# EAGLE design Power Distribution (EAGLE 6.4)
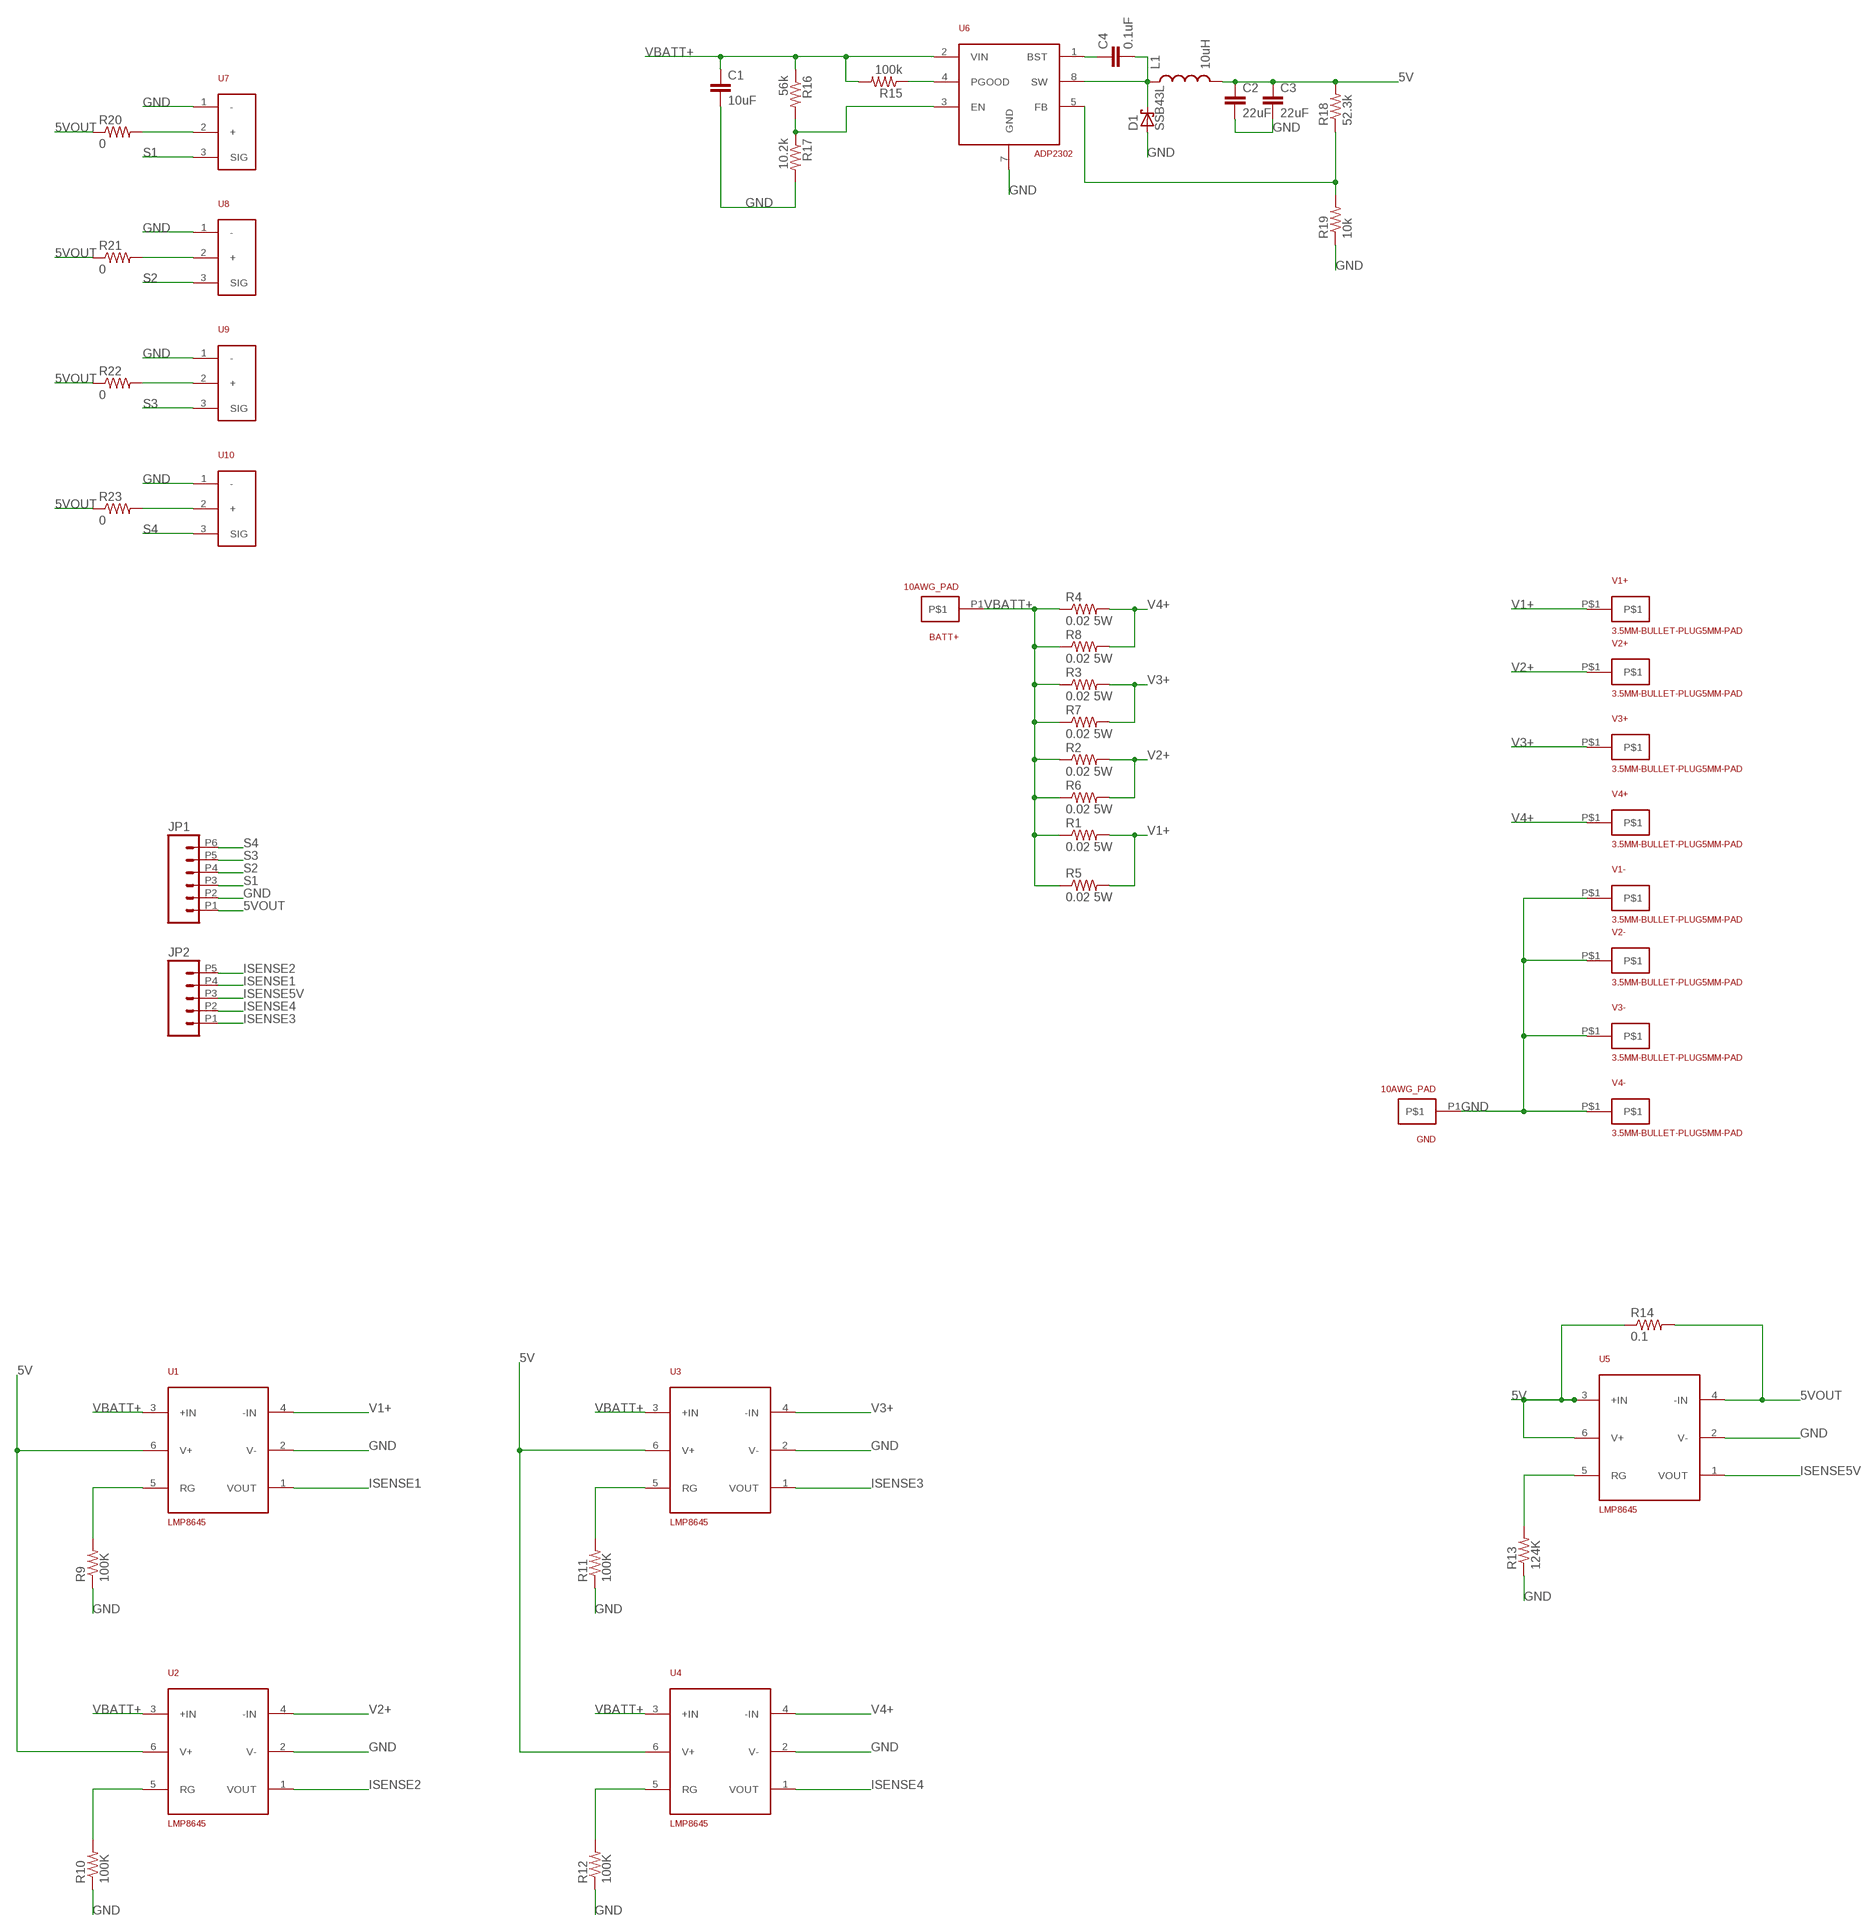
[diagram p0: schematic, sheet 1]

## Parts
BATT+  10AWG_PAD  [10AWG_SOLDERPAD]
C1  10uF  CAP0603-CAP  [0603-CAP]
C2  22uF  CAP0603-CAP  [0603-CAP]
C3  22uF  CAP0603-CAP  [0603-CAP]
C4  0.1uF  CAP0603-CAP  [0603-CAP]
D1  SSB43L  SCHOTTKY-DIODESMD  [SMB]
GND  10AWG_PAD  [10AWG_SOLDERPAD]
JP1  M06DF13  [DF13A-6P-1.25H]
JP2  M05DF13  [DF13A-5P-1.25H]
L1  10uH  INDUCTOR0603  [0603]
R1  0.02 5W  RESISTOR2512  [R2512]
R2  0.02 5W  RESISTOR2512  [R2512]
R3  0.02 5W  RESISTOR2512  [R2512]
R4  0.02 5W  RESISTOR2512  [R2512]
R5  0.02 5W  RESISTOR2512  [R2512]
R6  0.02 5W  RESISTOR2512  [R2512]
R7  0.02 5W  RESISTOR2512  [R2512]
R8  0.02 5W  RESISTOR2512  [R2512]
R9  100K  RESISTOR0603-RES  [0603-RES]
R10  100K  RESISTOR0603-RES  [0603-RES]
R11  100K  RESISTOR0603-RES  [0603-RES]
R12  100K  RESISTOR0603-RES  [0603-RES]
R13  124K  RESISTOR0603-RES  [0603-RES]
R14  0.1  RESISTOR0603-RES  [0603-RES]
R15  100k  RESISTOR0603-RES  [0603-RES]
R16  56k  RESISTOR0603-RES  [0603-RES]
R17  10.2k  RESISTOR0603-RES  [0603-RES]
R18  52.3k  RESISTOR0603-RES  [0603-RES]
R19  10k  RESISTOR0603-RES  [0603-RES]
R20  0  RESISTOR0603-RES  [0603-RES]
R21  0  RESISTOR0603-RES  [0603-RES]
R22  0  RESISTOR0603-RES  [0603-RES]
R23  0  RESISTOR0603-RES  [0603-RES]
U1  LMP8645  [SOT23-6]
U2  LMP8645  [SOT23-6]
U3  LMP8645  [SOT23-6]
U4  LMP8645  [SOT23-6]
U5  LMP8645  [SOT23-6]
U6  ADP2302  [SOIC8]
U7  SERVOPLUGTHROUGHHOLE_0.1PITCH  [0.1-PITCH-3CONN_RANGLE]
U8  SERVOPLUGTHROUGHHOLE_0.1PITCH  [0.1-PITCH-3CONN_RANGLE]
U9  SERVOPLUGTHROUGHHOLE_0.1PITCH  [0.1-PITCH-3CONN_RANGLE]
U10  SERVOPLUGTHROUGHHOLE_0.1PITCH  [0.1-PITCH-3CONN_RANGLE]
V1+  3.5MM-BULLET-PLUG5MM-PAD  [5MMPLUG]
V1-  3.5MM-BULLET-PLUG5MM-PAD  [5MMPLUG]
V2+  3.5MM-BULLET-PLUG5MM-PAD  [5MMPLUG]
V2-  3.5MM-BULLET-PLUG5MM-PAD  [5MMPLUG]
V3+  3.5MM-BULLET-PLUG5MM-PAD  [5MMPLUG]
V3-  3.5MM-BULLET-PLUG5MM-PAD  [5MMPLUG]
V4+  3.5MM-BULLET-PLUG5MM-PAD  [5MMPLUG]
V4-  3.5MM-BULLET-PLUG5MM-PAD  [5MMPLUG]

## Nets
5V: C2.1 C3.1 L1.2 R14.1 R18.2 U1.6(V+) U2.6(V+) U3.6(V+) U4.6(V+) U5.3(+IN) U5.6(V+)
5VOUT: JP1.P1 R14.2 R20.1 R21.1 R22.1 R23.1 U5.4(-IN)
GND: C1.2 C2.2 C3.2 D1.A GND.P1 JP1.P2 R9.1 R10.1 R11.1 R12.1 R13.1 R17.2 R19.1 U1.2(V-) U2.2(V-) U3.2(V-) U4.2(V-) U5.2(V-) U6.7(GND) U7.1(-) U8.1(-) U9.1(-) U10.1(-) V1-.P$1 V2-.P$1 V3-.P$1 V4-.P$1
ISENSE1: JP2.P4 U1.1(VOUT)
ISENSE2: JP2.P5 U2.1(VOUT)
ISENSE3: JP2.P1 U3.1(VOUT)
ISENSE4: JP2.P2 U4.1(VOUT)
ISENSE5V: JP2.P3 U5.1(VOUT)
N$1: R10.2 U2.5(RG)
N$2: R9.2 U1.5(RG)
N$3: R11.2 U3.5(RG)
N$4: R12.2 U4.5(RG)
N$5: R13.2 U5.5(RG)
N$7: C4.1 U6.1(BST)
N$8: C4.2 D1.C L1.1 U6.8(SW)
N$9: R20.2 U7.2(+)
N$10: R18.1 R19.2 U6.5(FB)
N$11: R15.1 U6.4(PGOOD)
N$12: R16.2 R17.1 U6.3(EN)
N$13: R21.2 U8.2(+)
N$14: R22.2 U9.2(+)
N$15: R23.2 U10.2(+)
S1: JP1.P3 U7.3(SIG)
S2: JP1.P4 U8.3(SIG)
S3: JP1.P5 U9.3(SIG)
S4: JP1.P6 U10.3(SIG)
V1+: R1.2 R5.2 U1.4(-IN) V1+.P$1
V2+: R2.2 R6.2 U2.4(-IN) V2+.P$1
V3+: R3.2 R7.2 U3.4(-IN) V3+.P$1
V4+: R4.2 R8.2 U4.4(-IN) V4+.P$1
VBATT+: BATT+.P1 C1.1 R1.1 R2.1 R3.1 R4.1 R5.1 R6.1 R7.1 R8.1 R15.2 R16.1 U1.3(+IN) U2.3(+IN) U3.3(+IN) U4.3(+IN) U6.2(VIN)

## Library data of the parts
BATT+ GND = PowerDistributionv1:10AWG_PAD
C1-C4 = PowerDistributionv1:CAP: Capacitor Standard 0603 ceramic capacitor, and 0.1" leaded capacitor.
D1 = PowerDistributionv1:SCHOTTKY-DIODE: Schottky Diode
JP1 = PowerDistributionv1:M06: Header 6 Standard 6-pin 0.1" header. Use with straight break away headers (SKU : PRT-00116), right angle break away headers (PRT-00553), swiss pins (PRT-00743), machine pins (PRT-00117), and female headers (PRT-00115). Molex polarized connector foot print use with SKU : PRT-08094 with associated crimp pins and housings. NOTES ON THE VARIANTS LOCK and LOCK_LONGPADS... This footprint was designed to help hold the alignment of a through-hole component (i.e. 6-pin header) while soldering it into place. You may notice that each hole has been shifted either up or down by 0.005 of an inch from it's more standard position (which is a perfectly straight line). This slight alteration caused the pins (the squares in the middle) to touch the edges of the holes. Because they are alternating, it causes a "brace" to hold the component in place. 0.005 has proven to be the perfect amount of "off-center" position when using our standard breakaway headers. Although looks a little odd when you look at the bare footprint, once you have a header in there, the alteration is very hard to notice. Also, if you push a header all the way into place, it is covered up entirely on the bottom side. This idea of altering the position of holes to aid alignment will be further integrated into the Sparkfun Library for other footprints. It can help hold any component with 3 or more connection pins.
JP2 = PowerDistributionv1:M05: Header 5 Standard 5-pin 0.1" header. Use with straight break away headers (SKU : PRT-00116), right angle break away headers (PRT-00553), swiss pins (PRT-00743), machine pins (PRT-00117), and female headers (PRT-00115). Molex polarized connector foot print use with SKU : PRT-08230 with associated crimp pins and housings.
L1 = PowerDistributionv1:INDUCTOR: Inductors Basic Inductor/Choke - 0603 and 1206. Footprints are not proven and vary greatly between part numbers.
R1-R23 = PowerDistributionv1:RESISTOR: Resistor Basic schematic elements and footprints for 0603, 1206, and PTH resistors.
U1-U5 = PowerDistributionv1:LMP8645
U6 = PowerDistributionv1:ADP2302
U7-U10 = PowerDistributionv1:SERVOPLUG
V1+ V1- V2+ V2- V3+ V3- V4+ V4- = PowerDistributionv1:3.5MM-BULLET-PLUG

## Board
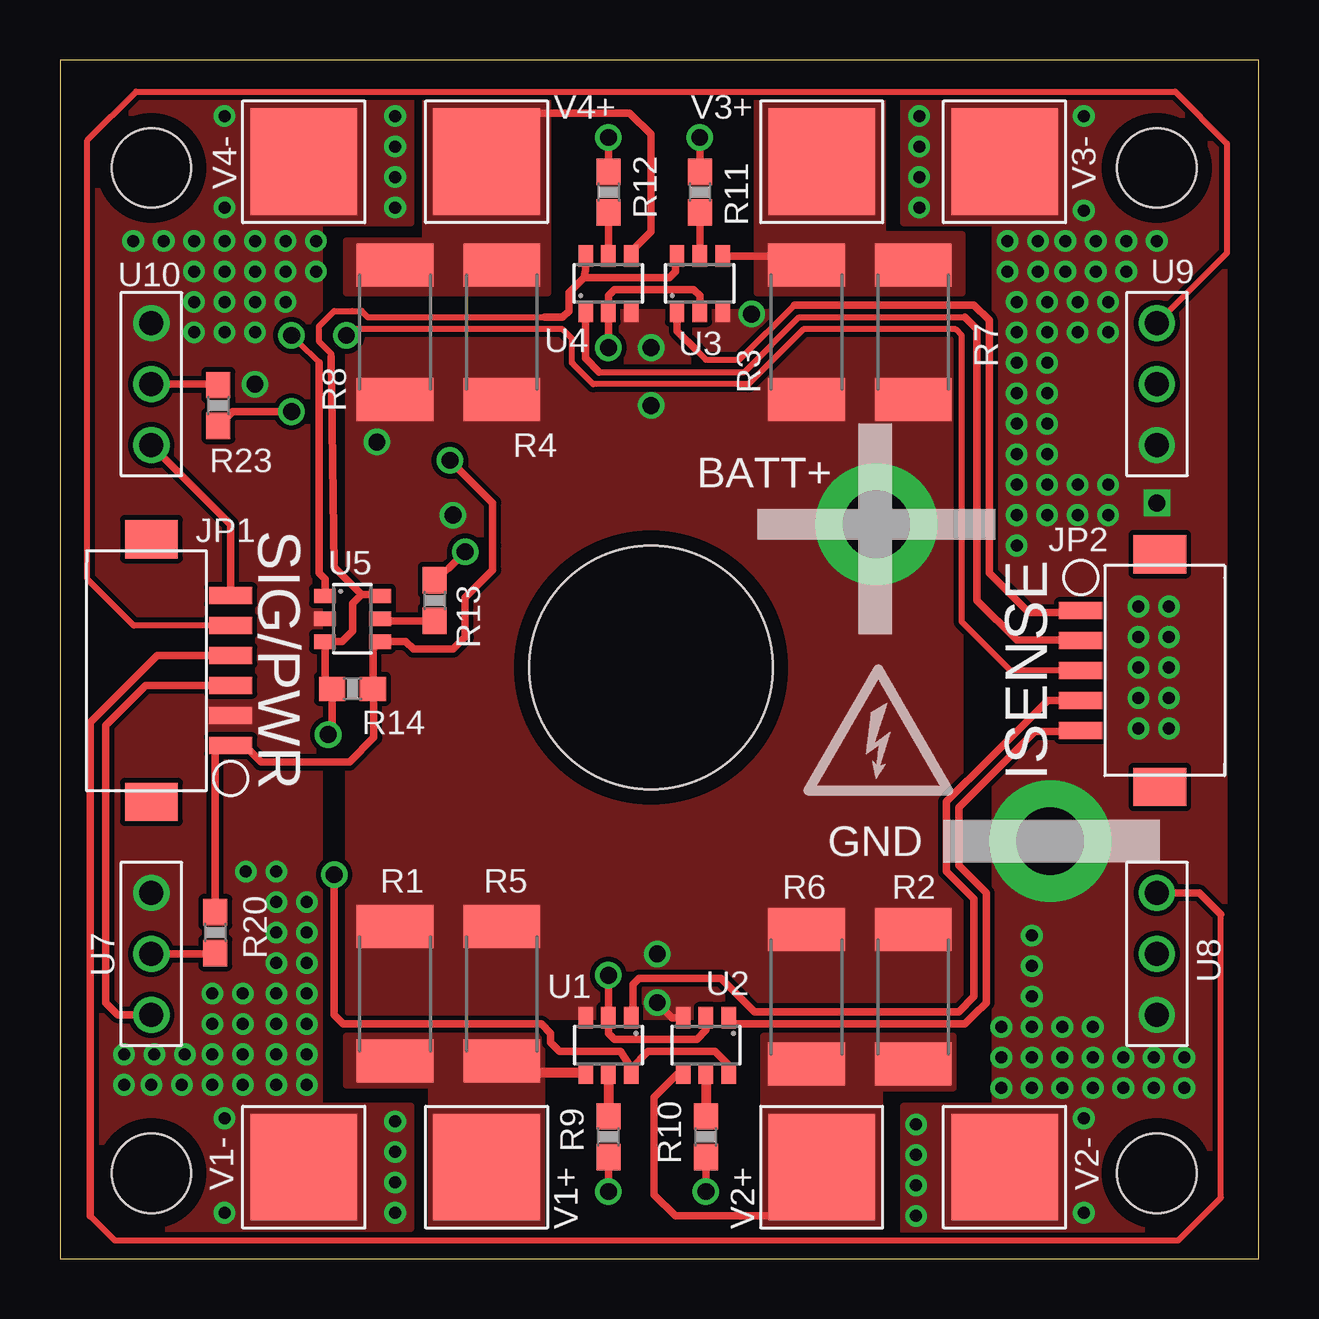
[diagram p1: board, top side]
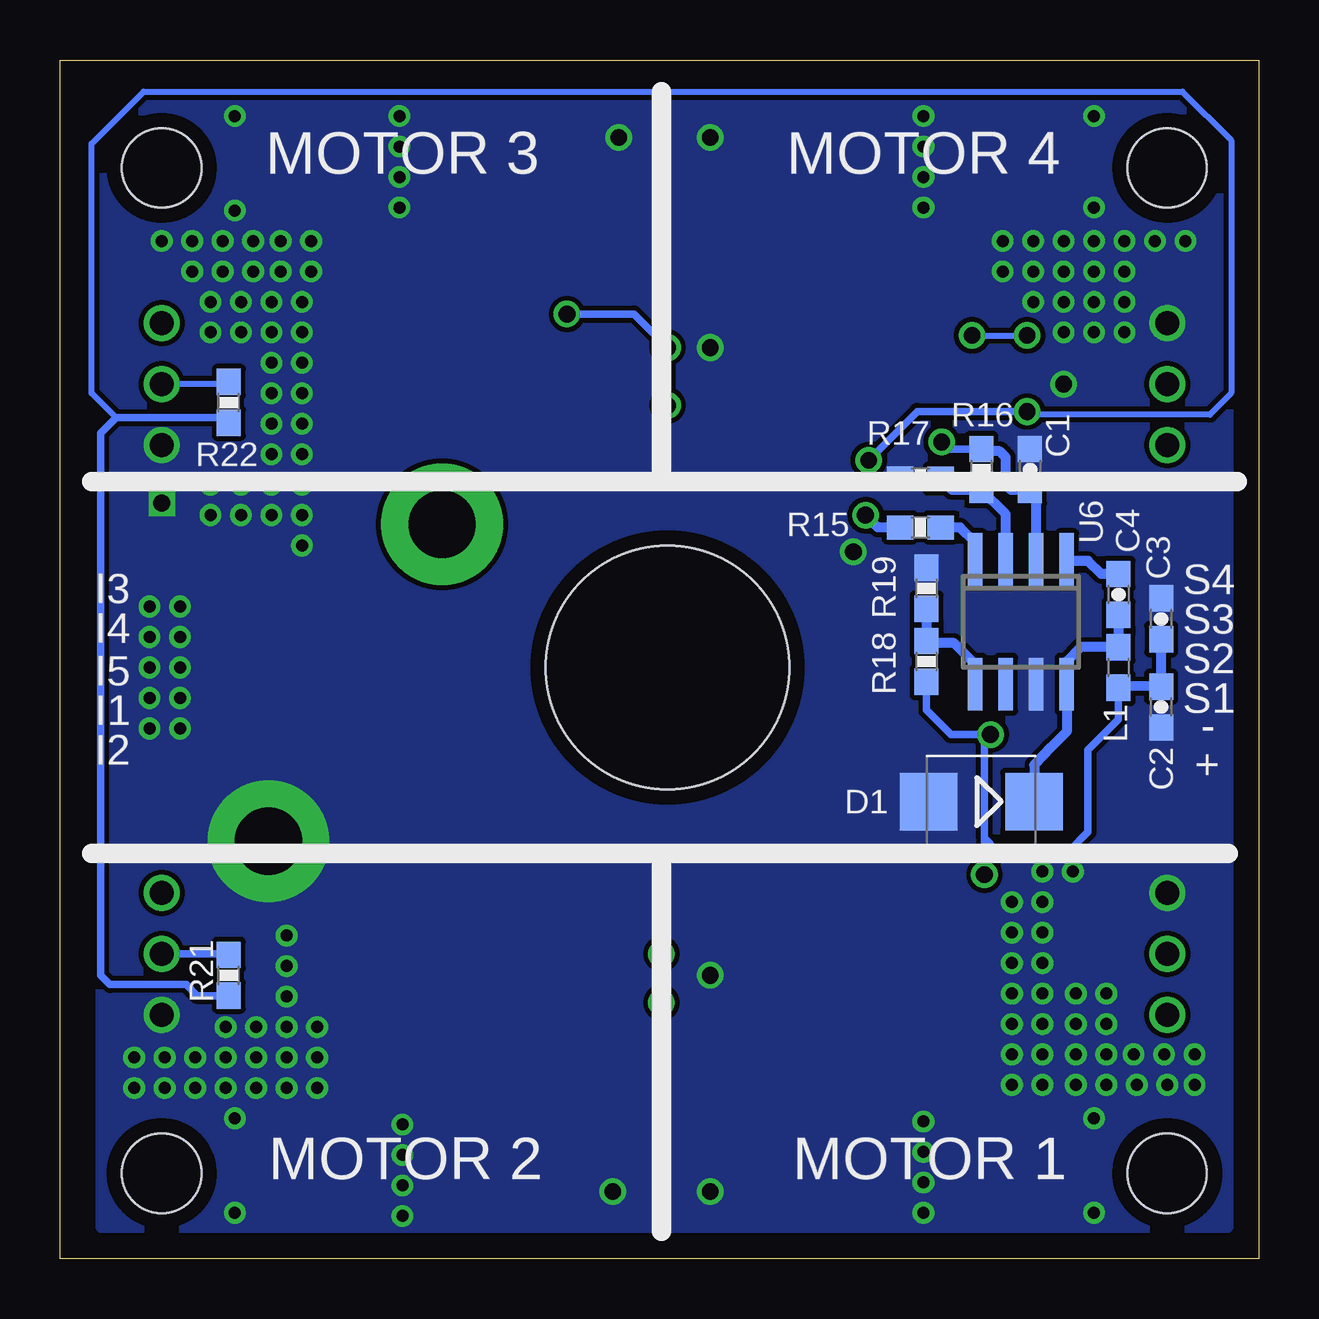
[diagram p2: board, bottom side, seen from below]

Size 49.96 x 49.96 mm. Coordinates in mm from the lower left corner, seen from the top.
Outline: 0,0 49.96,0 49.96,49.96 0,49.96 0,0
Copper layers (1*16): Top 0.035mm / dielectric 1.5mm / Bottom 0.035mm
Design rules "default *": minimum track width 10mil, minimum drill 15mil, track to track 8mil, track to pad 8mil, pad to pad 8mil, via to via 8mil, smd to smd 8mil, copper to edge 25mil, drill to drill 8mil, minimum pad ring 10mil, minimum via ring 8mil, stop-mask expansion 4mil, vias tented up to drill 20mil, thermal gap 10mil
Holes 10.16 mm at 24.64,24.64

### Footprints (pad centres in the part's own frame; a part is rotated, then mirrored left to right if it is on the bottom)
10AWG_SOLDERPAD = drill 2.8 pad 5.08: P1 0,0
0603-CAP = smd 1.1 x 1: 1 -0.85,0; 2 0.85,0
SMB = smd 2.4 x 2.4: A 2.2,0; C -2.2,0
DF13A-6P-1.25H = smd 0.7 x 1.8: P1 -3.125,0; P2 -1.875,0; P3 -0.625,0; P4 0.625,0; P5 1.875,0; P6 3.125,0 | smd 1.6 x 2.2: PAD@1 -5.475,3.3; PAD@2 5.475,3.3
DF13A-5P-1.25H = smd 0.7 x 1.8: P1 -2.5,0; P2 -1.25,0; P3 0,0; P4 1.25,0; P5 2.5,0 | smd 1.6 x 2.2: PAD@1 -4.85,3.3; PAD@2 4.85,3.3
0603 = smd 1.1 x 1: 1 -0.85,0; 2 0.85,0
R2512 = smd 1.8 x 3.2: 1 -2.8,0; 2 2.8,0
0603-RES = smd 1.1 x 1: 1 -0.85,0; 2 0.85,0
SOT23-6 = smd 0.6 x 0.9: 1 -0.95,-1.15; 2 0,-1.15; 3 0.95,-1.15; 4 0.95,1.15; 5 0,1.15; 6 -0.95,1.15
SOIC8 = smd 0.6 x 2.2: 1 -1.905,-2.6; 2 -0.635,-2.6; 3 0.635,-2.6; 4 1.905,-2.6; 5 1.905,2.6; 6 0.635,2.6; 7 -0.635,2.6; 8 -1.905,2.6
0.1-PITCH-3CONN_RANGLE = drill 1: 1 -2.54,0; 2 0,0; 3 2.54,0
STAND-OFF = hole 3.302: 0,0
5MMPLUG = smd 4.445 x 4.445: P$1 0,0

### Placement (x,y rotation side)
BATT+  34.04,30.61 0 top
C1  9.53,32.89 90 bottom
C2  4.06,22.99 270 bottom
C3  4.06,26.67 90 bottom
C4  5.84,27.69 270 bottom
D1  11.56,19.05 180 bottom
GND  41.27,17.4 0 top
JP1  7.11,24.51 90 top
JP2  42.55,24.51 270 top
L1  5.84,24.64 270 bottom
R1  13.97,11.05 270 top
R2  35.56,10.92 270 top
R3  31.11,38.61 90 top
R4  18.41,38.61 90 top
R5  18.41,11.05 270 top
R6  31.11,10.92 270 top
R7  35.56,38.61 90 top
R8  13.97,38.61 90 top
R9  22.86,5.08 90 top
R10  26.92,5.08 90 top
R11  26.67,44.45 270 top
R12  22.86,44.45 270 top
R13  15.62,27.43 270 top
R14  12.19,23.75 0 top
R15  14.1,30.48 180 bottom
R16  11.56,32.89 270 bottom
R17  14.1,32.51 180 bottom
R18  13.84,24.89 270 bottom
R19  13.84,27.94 270 bottom
R20  6.48,13.59 270 top
R21  42.93,11.81 90 bottom
R22  42.93,35.69 90 bottom
R23  6.6,35.56 90 top
U1  22.86,8.89 180 top
U2  26.92,8.89 180 top
U3  26.67,40.64 0 top
U4  22.86,40.64 0 top
U5  12.19,26.67 270 top
U6  9.91,26.54 180 bottom
U7  3.81,12.7 270 top
U8  45.72,12.7 90 top
U9  45.72,36.45 90 top
U10  3.81,36.45 270 top
U$1  [STAND-OFF]  3.81,3.56 0 top
U$2  [STAND-OFF]  45.72,3.56 0 top
U$3  [STAND-OFF]  45.72,45.47 0 top
U$4  [STAND-OFF]  3.81,45.47 0 top
U$5  [SHOCK_HAZARD]  30.86,19.18 0 top
V1+  17.78,3.81 180 top
V1-  10.16,3.81 180 top
V2+  31.75,3.81 180 top
V2-  39.37,3.81 180 top
V3+  31.75,45.72 0 top
V3-  39.37,45.72 0 top
V4+  17.78,45.72 0 top
V4-  10.16,45.72 0 top

### Tracks (layer width: path | path; a pad name or v marks a point on that pad's centre or on a via)
5V  (via drill 0.7)
  Top 0.254: 11.3,37.59 11.3,37.72 10.79,38.23 10.79,38.86 11.43,39.5 12.19,39.5 12.57,39.5 12.83,39.24 20.57,39.24
  Top 0.305: U1.6 23.81,7.93 23.81,7.94 | 23.81,7.94 24.51,8.64 27.3,8.64 27.81,8.13 27.81,7.67 U2.6 | U4.6 21.91,41.21 21.84,40.89 | 21.84,40.89 25.4,40.89 25.65,41.15 25.65,41.72 U3.6 | 12.57,27.69 12.19,27.3 12.19,26.16 11.75,25.72 U5.3 11.04,24.05 R14.1 11.34,22.01 v11.18,21.84 | 12.57,27.69 13.28,27.69 U5.6 | 11.3,37.59 11.43,28.83 12.57,27.69 | v11.43,16 11.43,10.16 11.81,9.78 20.07,9.78 20.45,9.4 20.45,9.02 20.83,8.64 23.37,8.64 23.81,7.94 | 20.19,39.24 20.57,39.24 20.95,39.24 21.21,39.5 21.21,40.26 21.84,40.89
  Bottom 0.305: R18.2 13.84,22.86 12.83,21.84 v11.18,21.84 11.43,21.59 11.43,17.53 | L1.2 5.84,22.48 7.11,21.21 7.11,17.78 7.87,17.02 10.92,17.02 11.43,17.53 | 11.43,17.53 v11.43,16
  Bottom 0.406: L1.2 5.75,23.88 C2.1 C3.1
5VOUT  (via drill 0.7)
  Top 0.305: R20.1 6.48,21.21 6.6,21.34 6.65,21.39 JP1.P1 7.7,21.39 8.38,20.7 12.06,20.7 13.08,21.72 13.08,23.71 R14.2 13.04,25.42 U5.4 14.41,25.72 14.73,25.4 16.38,25.4 16.89,25.91 16.89,27.56 18.03,28.7 18.03,29.72 18.03,31.5 v16.26,33.27 | v9.65,35.31 7.2,35.31 R23.1
  Bottom 0.254: R22.1 43.12,34.84 43.33,35.05 47.62,35.05 48.64,36.07 48.64,46.48 46.48,48.64 3.17,48.64 1.14,46.61 1.14,36.07 2.03,35.18 9.53,35.18 v9.65,35.31
  Bottom 0.305: v16.26,33.27 14.22,35.31 v9.65,35.31 | R21.1 44.23,10.96 44.7,11.43 47.88,11.43 48.26,11.81 48.26,34.42 47.62,35.05 43.33,35.05 43.14,35.05 R22.1
GND  (via drill 0.5, 0.5 pad 0.41, 0.7)
  Top 0.305: U2.2 26.92,9.53 26.54,9.14 23.11,9.14 22.86,9.4 U1.2 v22.86,11.81 | v22.86,2.79 R9.1 | v26.92,2.79 R10.1 | U3.2 26.67,40.13 26.42,40.39 23.11,40.39 22.86,40.13 U4.2 v22.86,37.97 | v22.86,46.74 R12.1 | v26.67,46.74 R11.1 | R13.1 16.22,28.79 v16.89,29.46
  other vias: 13.97,5.71 13.97,4.45 13.97,3.17 13.97,1.91 6.35,7.24 7.62,7.24 6.86,5.84 6.86,1.91 6.86,47.62 13.97,47.62 13.97,46.35 13.97,45.09 13.97,43.81 6.86,43.81 8.13,42.42 6.86,42.42 35.69,1.78 35.69,3.05 35.69,4.32 35.69,5.59 42.67,1.91 42.67,5.84 43.05,7.11 41.78,7.11 35.81,43.81 35.81,45.09 35.81,46.35 35.81,47.62 7.62,11.05 41.78,8.38 43.05,8.38 6.35,11.05 7.62,8.51 6.35,8.51 5.08,7.24 3.81,7.24 43.05,9.65 41.78,9.65 7.62,9.78 6.35,9.78 42.67,43.69 41.91,42.42 43.18,42.42 42.67,47.62 41.91,41.15 43.18,41.15 44.45,42.42 45.72,42.42 44.45,41.15 45.72,31.5 44.32,7.11 45.59,7.11 10.29,7.24 10.29,8.51 10.29,9.78 10.29,11.05 39.5,42.42 39.5,41.15 43.69,39.88 42.42,39.88 43.69,38.61 42.42,38.61 8.13,41.15 6.86,41.15 5.59,42.42 5.59,41.15 6.86,39.88 5.59,39.88 8.13,39.88 5.59,38.61 4.32,42.42 3.05,42.42 8.13,36.45 6.86,38.61 8.13,38.61 9.02,7.24 9.02,8.51 9.02,9.78 9.02,11.05 10.29,12.32 9.02,12.32 9.02,13.59 10.29,13.59 10.29,14.86 9.02,14.86 9.02,16.13 7.75,16.13 2.67,7.24 2.67,8.51 3.94,8.51 5.21,8.51 9.4,42.42 9.4,41.15 9.4,39.88 10.67,42.42 10.67,41.15 40.77,42.42 40.77,41.15 41.15,39.88 41.15,38.61 39.88,38.61 39.88,39.88 39.88,37.34 39.88,36.07 39.88,34.8 39.88,33.53 39.88,32.26 39.88,30.99 39.88,29.72 41.15,37.34 41.15,36.07 41.15,34.8 41.15,33.53 41.15,32.26 41.15,30.99 42.42,32.26 43.69,32.26 42.42,30.99 43.69,30.99 44.96,27.18 46.23,27.18 44.96,25.91 44.96,24.64 44.96,23.37 44.96,22.1 46.23,22.1 46.23,24.64 46.23,25.91 46.23,23.37 46.86,7.11 44.32,8.38 46.86,8.38 45.59,8.38 40.51,9.65 39.24,9.65 39.24,8.38 39.24,7.11 40.51,7.11 40.51,8.38 40.51,10.92 40.51,12.19 40.51,13.46
  pour Bottom (no thermals): 48.26,1.27 48.26,48.26 1.27,48.26 1.27,43.18 1.27,1.27
  pour Top (no thermals): 1.27,1.27 14.61,1.27 14.61,6.35 10.79,6.35 10.79,43.18 14.61,43.18 14.61,48.39 1.27,48.39
  pour Top (no thermals): 48.51,48.26 35.18,48.26 35.18,43.18 38.99,43.18 38.99,6.35 35.18,6.35 35.18,1.14 48.51,1.14
ISENSE1
  Top 0.305: JP2.P4 41.17,23.26 38.73,20.83 36.96,19.05 36.96,16.13 38.1,14.99 38.1,10.92 37.47,10.29 28.96,10.29 28.45,10.79 27.56,11.68 24.13,11.68 23.88,11.43 23.88,10.11 U1.1
ISENSE2
  Top 0.305: U2.1 27.93,9.91 27.94,9.91 28.07,9.78 37.72,9.78 38.1,10.16 38.61,10.67 38.61,15.24 37.47,16.38 37.47,18.8 38.86,20.19 40.64,21.97 42.51,21.97 JP2.P5
ISENSE3
  Top 0.254: 26.54,37.85 26.92,37.47 27.56,37.47 28.32,37.47 30.61,39.75
  Top 0.305: U3.1 25.72,38.67 26.54,37.85 | 30.61,39.75 38.1,39.75 38.73,39.12 38.73,28.57 40.39,26.92 42.46,26.92 JP2.P1
ISENSE4
  Top 0.254: 22.48,36.96 28.52,36.96 30.81,39.24 37.72,39.24
  Top 0.305: U4.1 21.91,37.53 22.48,36.96 | 37.72,39.24 38.23,38.73 38.23,27.43 39.88,25.78 42.52,25.78 JP2.P2
ISENSE5V  (via drill 0.7)
  Top 0.254: JP2.P3 39.62,24.51 37.59,26.54 37.59,38.48 37.34,38.73 30.99,38.73 28.7,36.45 22.23,36.45 21.46,37.21 21.34,37.34 21.34,38.35 20.95,38.73 12.19,38.73 12.06,38.61 v11.94,38.48 | v9.65,38.48 9.91,38.23 10.79,37.34
  Top 0.305: U5.1 11.04,28.33 10.79,28.57 10.79,28.83 10.79,29.08 10.79,37.34
  Bottom 0.254: v11.94,38.48 10.16,38.48 v9.65,38.48
N$1
  Top 0.406: U2.5 R10.2
N$2
  Top 0.406: U1.5 R9.2
N$3
  Top 0.305: U3.5 R11.2
N$4
  Top 0.305: U4.5 R12.2
N$5
  Top 0.305: R13.2 13.43,26.58 U5.5
N$7
  Bottom 0.406: C4.1 6.57,28.54 7.11,29.08 7.94,29.08 U6.1
N$8
  Bottom 0.406: D1.C 9.36,20.57 8.64,21.34 8,21.97 U6.8 8,24.89 7.41,25.49 L1.1 C4.2
N$9
  Top 0.305: U7.2 6.44,12.7 R20.2
N$10
  Bottom 0.406: R19.2 R18.1 13.76,25.65 12.7,25.65 11.81,24.77 U6.5
N$11
  Bottom 0.406: U6.4 11.81,29.84 12.45,30.48 R15.1
N$12
  Bottom 0.406: U6.3 10.54,31.03 R16.2 12.78,32.04 R17.1
N$13
  Bottom 0.305: R21.2 42.97,12.7 U8.2
N$14
  Bottom 0.254: 43.01,36.45 U9.2
  Bottom 0.305: 43.01,36.45 R22.2
N$15
  Top 0.305: U10.2 6.57,36.45 R23.2
S1
  Top 0.305: JP1.P3 3.57,23.89 1.91,22.23 1.91,10.67 2.41,10.16 U7.3
S2
  Top 0.254: 1.27,1.78 2.29,0.76 44.7,0.76 46.61,0.76 48.39,2.54 48.39,14.35
  Top 0.305: JP1.P4 4.05,25.14 1.27,22.35 1.27,5.21 1.27,4.83 1.27,4.06 1.27,1.78 | 48.39,14.35 47.5,15.24 U8.3
S3
  Top 0.254: JP1.P5 3.08,26.39 1.14,28.32 1.14,46.61 3.17,48.64 46.48,48.64 48.64,46.48 48.64,41.91 U9.3
S4
  Top 0.305: JP1.P6 7.11,30.61 U10.3
V1+
  Top 0.406: U1.4 19.8,7.74 19.68,7.62 19.04,7.62 R5.2
  pour Top (no thermals): 11.94,9.27 11.94,7.24 15.49,7.24 15.49,6.1 15.49,1.4 20.07,1.4 20.07,9.14 20.07,9.27
V2+
  Top 0.305: U2.4 25.72,7.69 24.77,6.73 24.77,2.67 25.65,1.78 30.48,1.78
  pour Top (no thermals): 29.34,1.4 29.34,9.14 29.34,9.27 37.21,9.27 37.21,7.11 34.16,7.11 34.16,3.05 34.16,1.4
V3+
  Top 0.305: U3.4 29.71,41.79 29.72,41.78
  pour Top (no thermals): 29.21,48.26 29.08,48.26 29.08,40.26 37.59,40.26 37.59,42.42 37.59,42.67 34.29,42.67 34.29,43.94 34.29,48.26
V4+
  Top 0.305: U4.4 23.81,41.97 24.64,42.8 24.64,46.86 23.75,47.75 19.3,47.75
  pour Top (no thermals): 11.94,42.29 11.94,40.39 11.94,40.26 20.32,40.26 20.32,44.2 20.32,48.26 15.24,48.26 15.24,43.31 15.24,42.42 11.94,42.42
VBATT+  (via drill 0.7)
  Top 0.305: U2.3 25.52,10.04 v24.89,10.67
  Bottom 0.305: R16.1 12.91,33.74 v13.21,34.04 | v24.89,12.7 v24.89,10.67 | v28.83,39.37 26.04,39.37 v24.64,37.97 v24.64,35.56
  Bottom 0.406: U6.2 9.27,31.79 C1.1 10.33,32.04 10.54,32.26 10.54,33.4 10.67,33.53 10.79,33.66 11.47,33.66 R16.1 | R15.2 15.88,30.48 16.13,30.73 v16.38,30.99
  pour Top (no thermals): 12.06,39.37 12.06,10.16 37.47,10.16 37.47,14.61 37.47,39.37

### Text on the board
tPlace: SIG/PWR | ISENSE
bPlace: MOTOR 4 | MOTOR 3 | S4 | I3 | S3 | I4 | S2 | I5 | S1 | - | I1 | I2 | + | MOTOR 1 | MOTOR 2